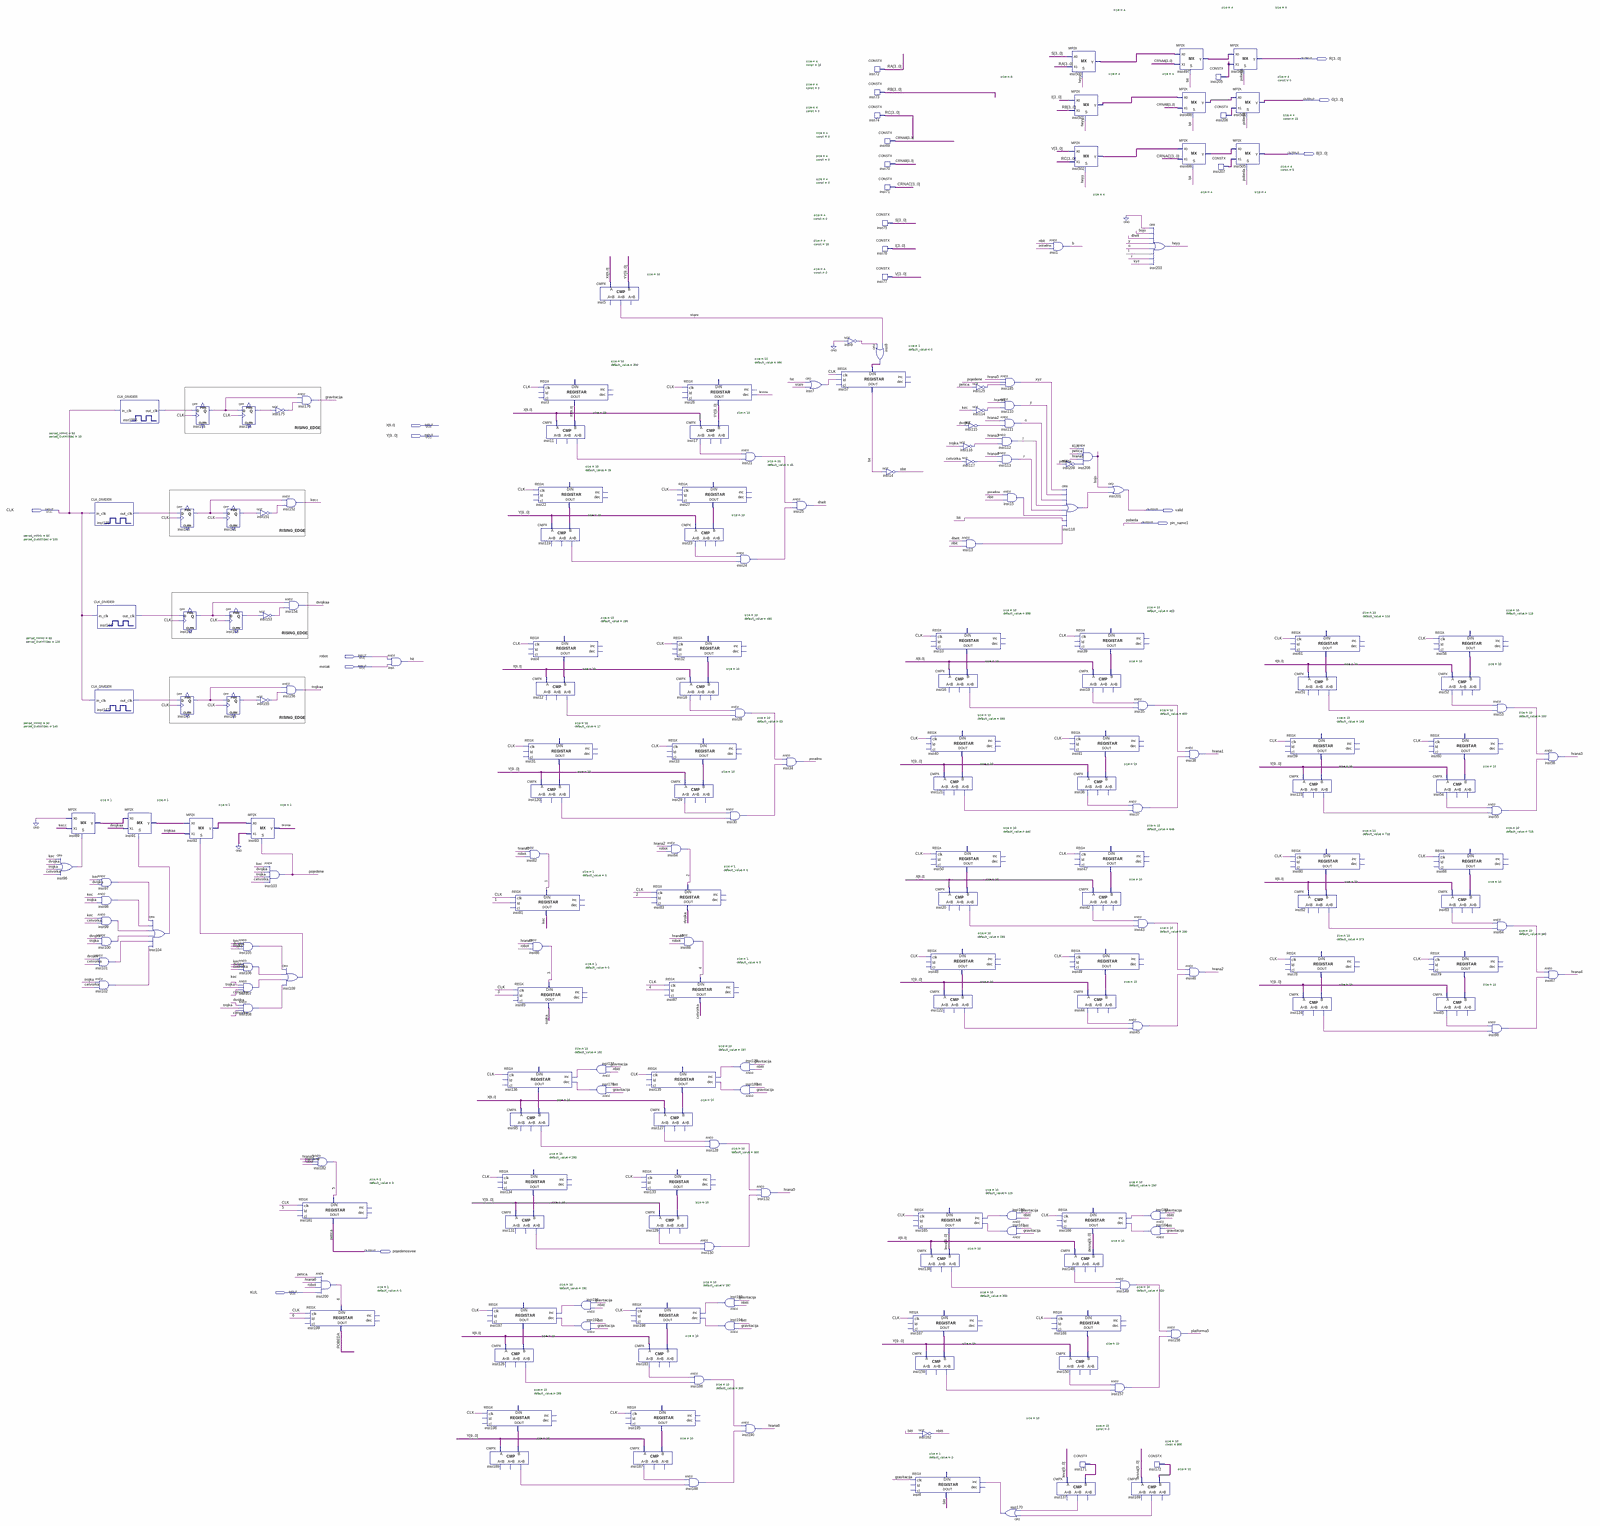
[diagram p0: schematic sheet, whole]
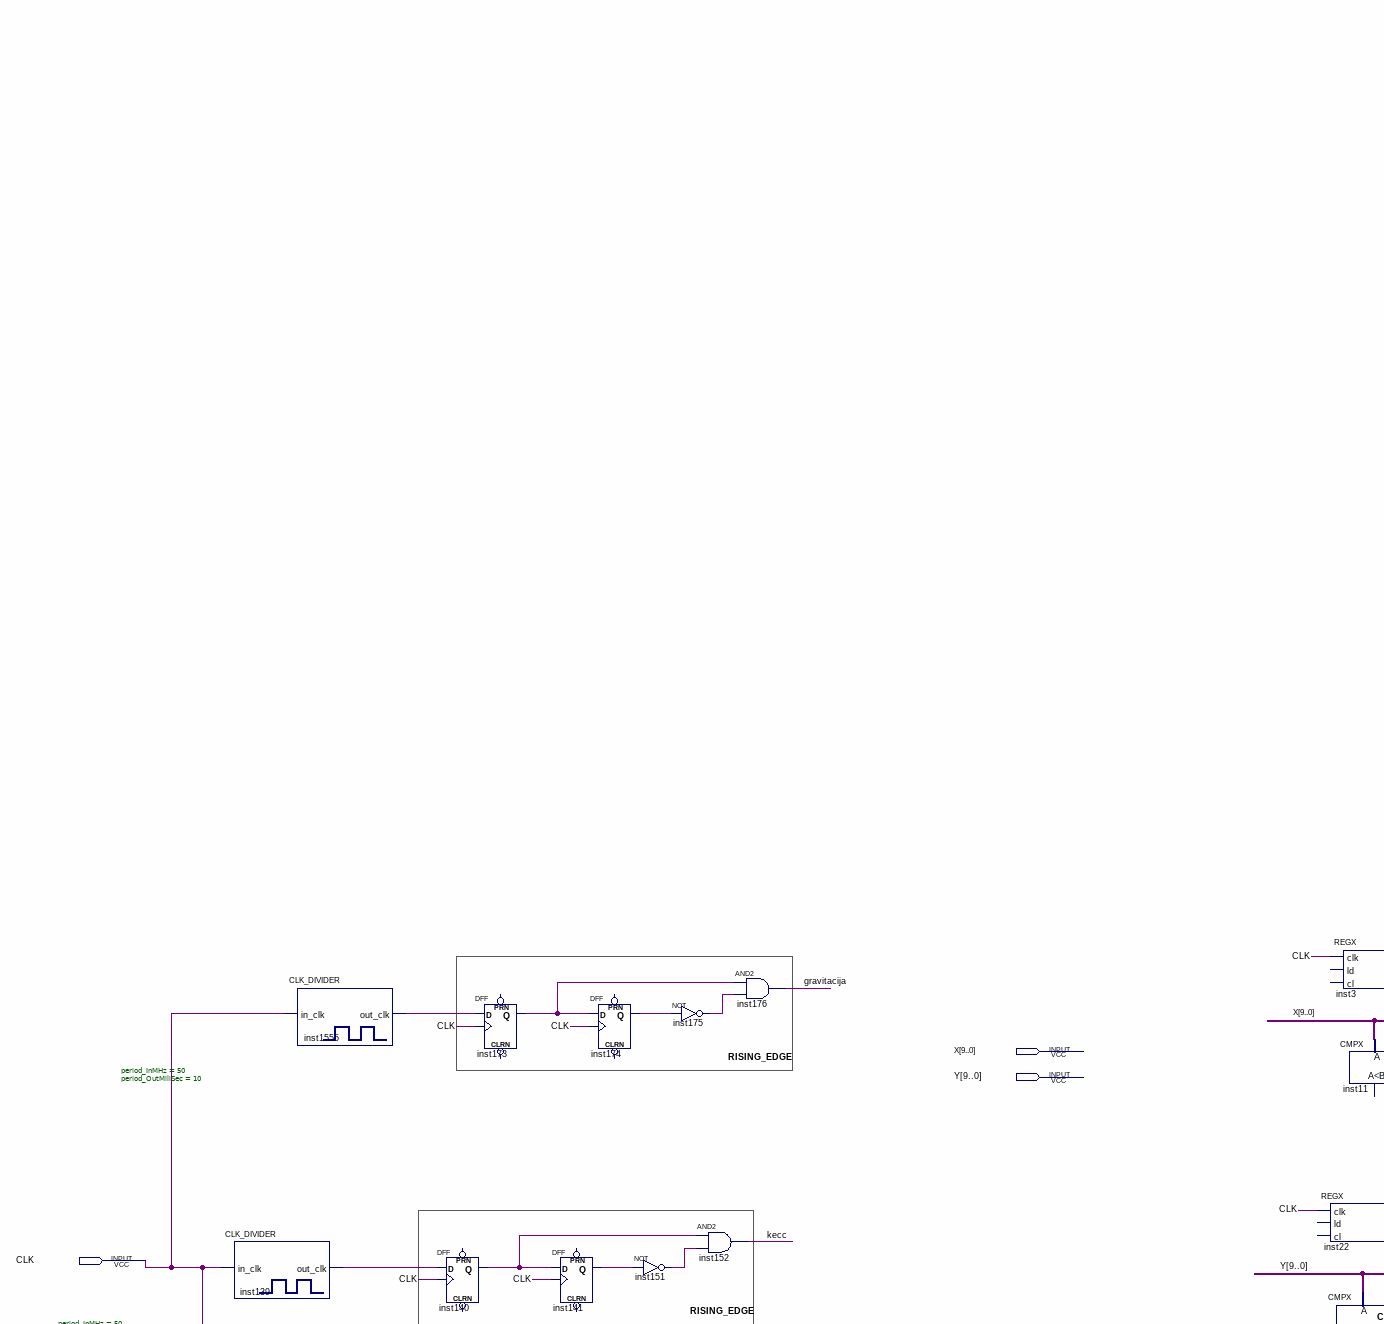
[diagram p1: schematic sheet, upper left part]
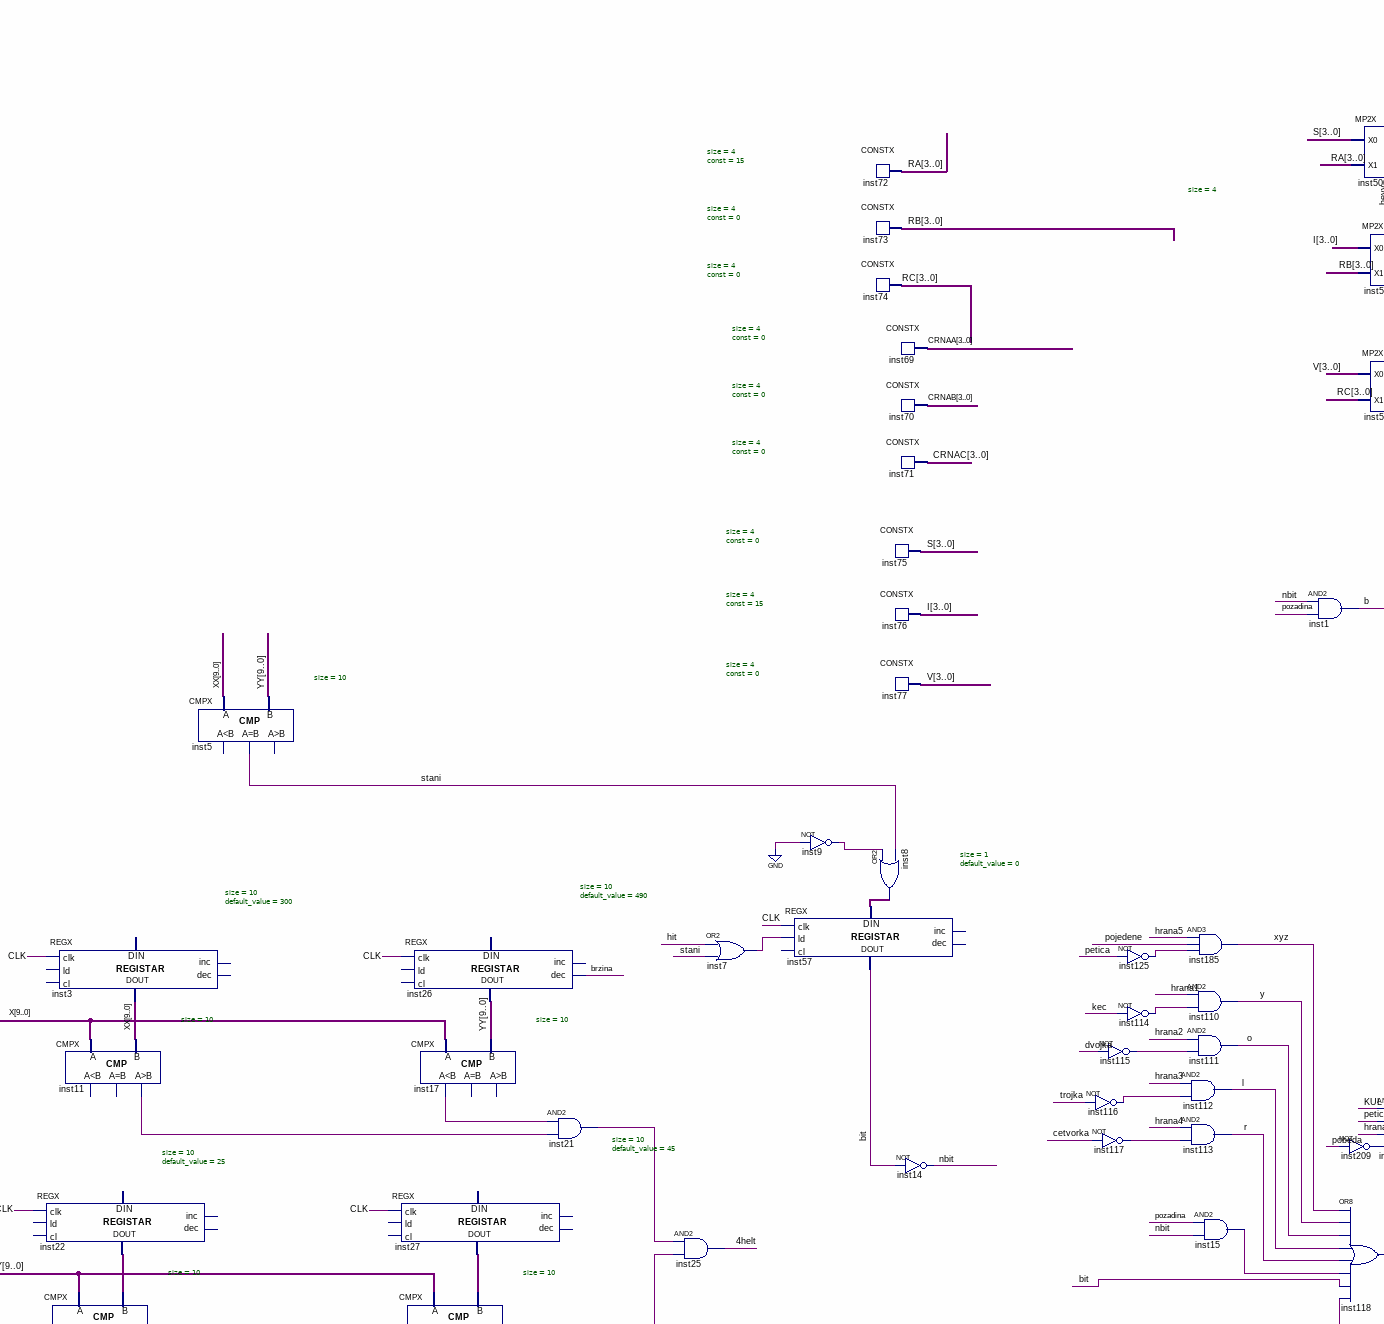
[diagram p2: schematic sheet, upper centre part]
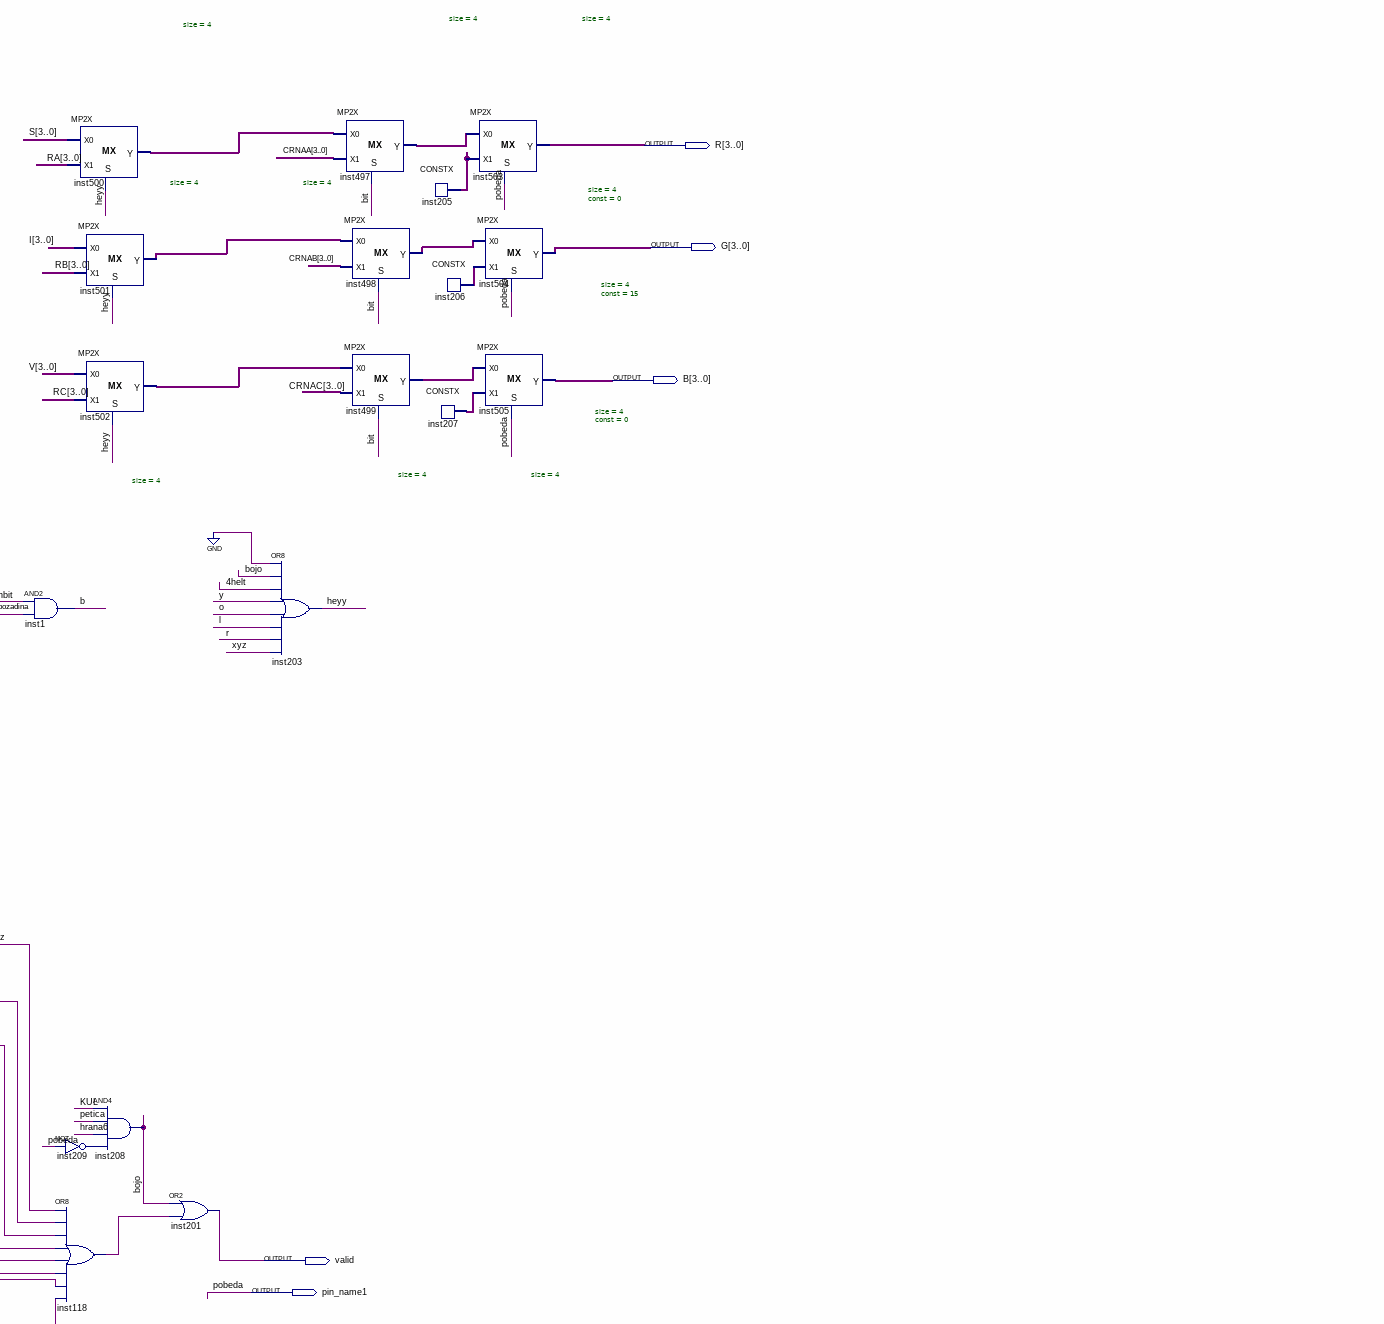
[diagram p3: schematic sheet, upper right part]
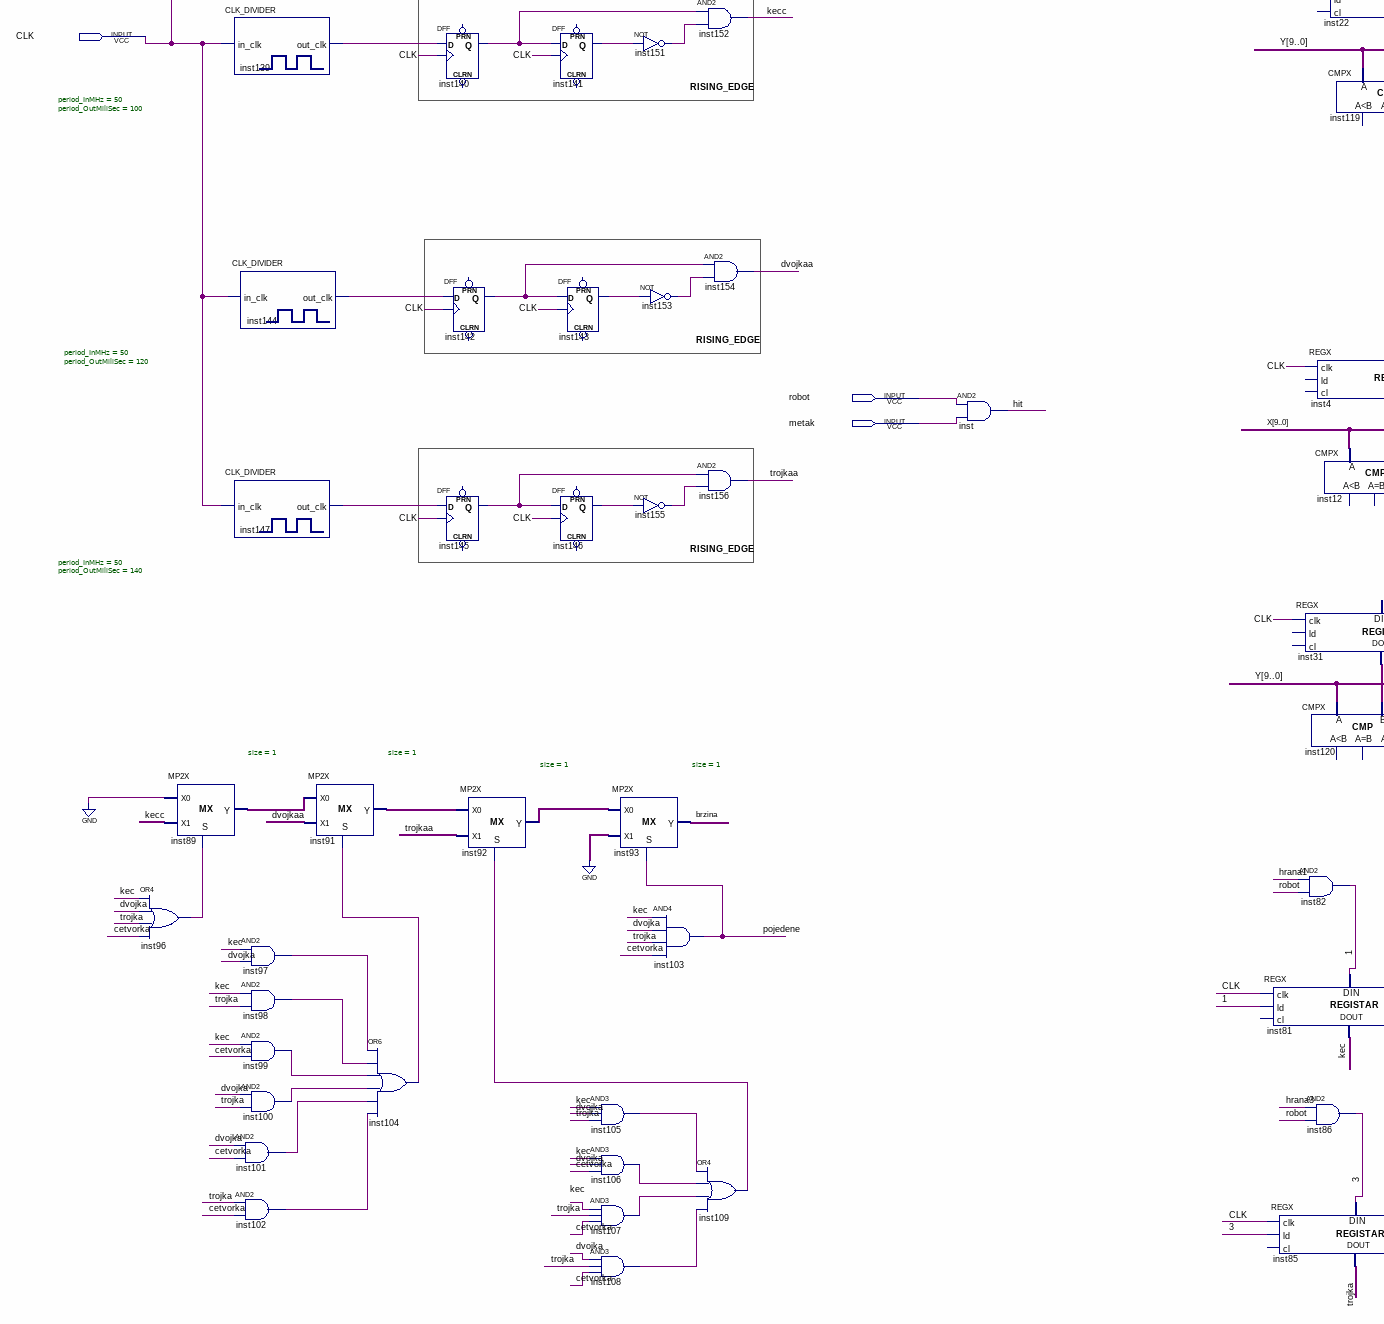
[diagram p4: schematic sheet, middle left part]
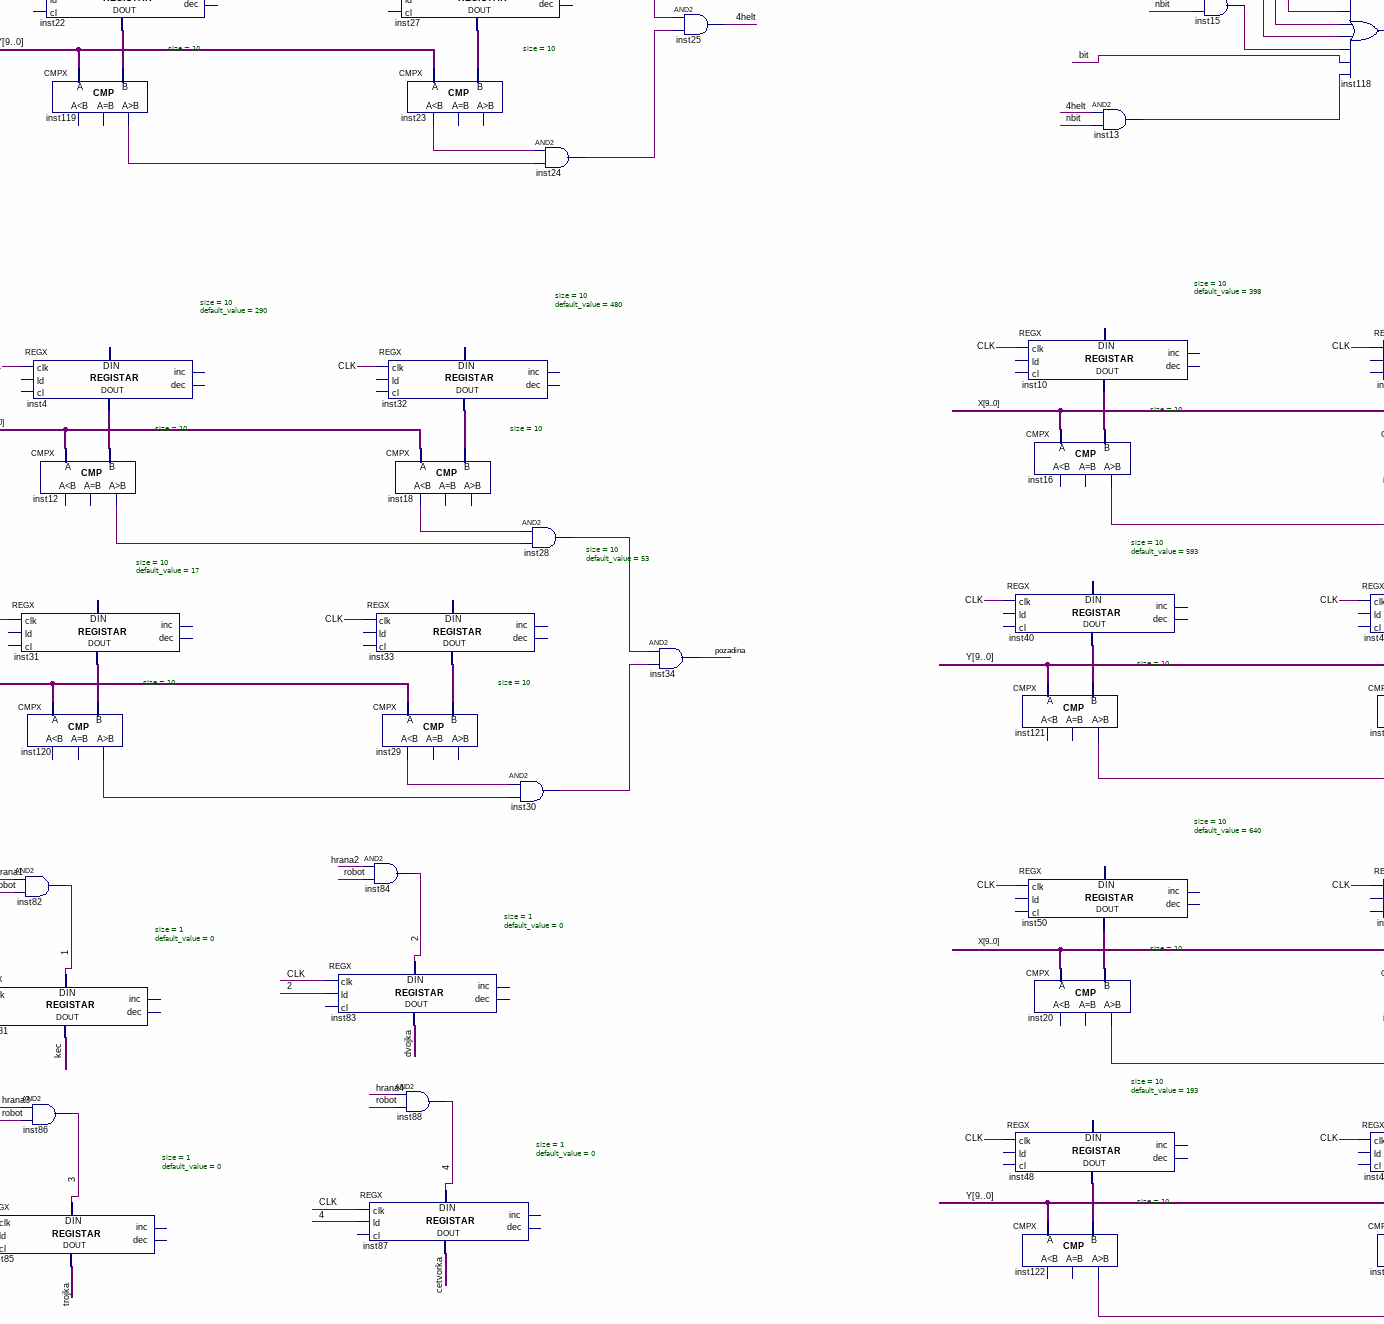
[diagram p5: schematic sheet, middle centre part]
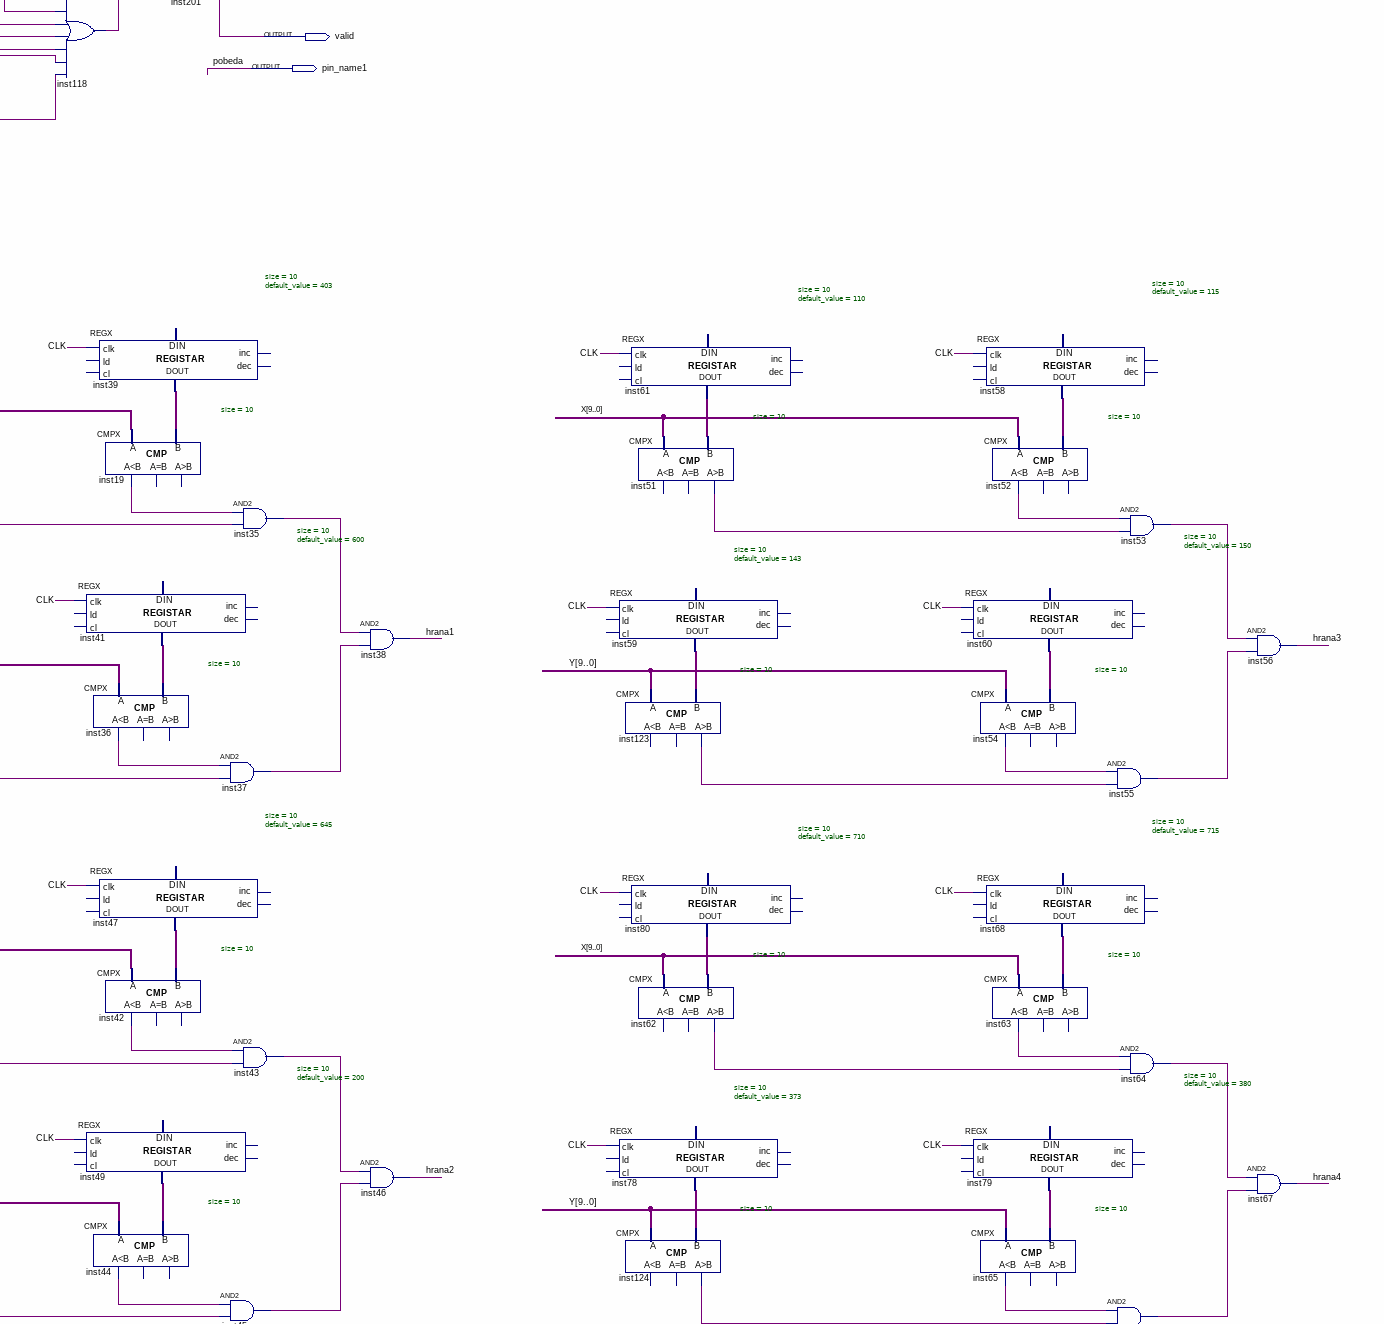
[diagram p6: schematic sheet, middle right part]
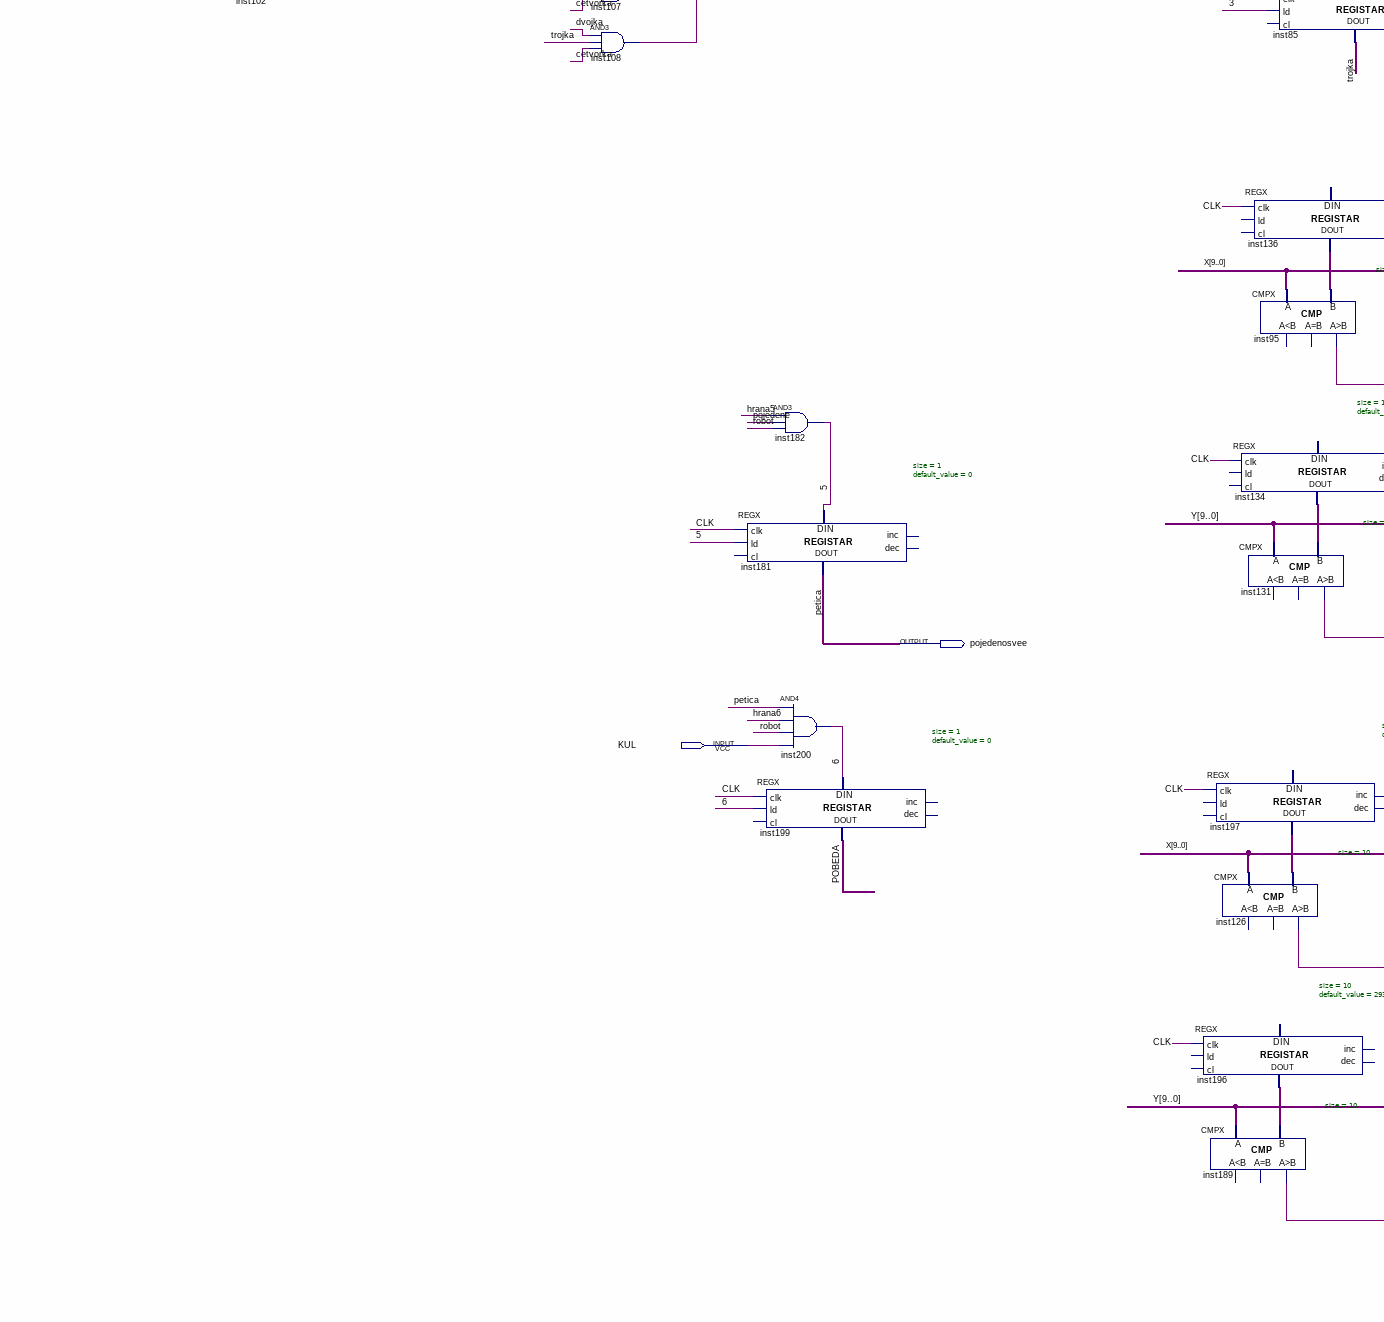
[diagram p7: schematic sheet, lower left part]
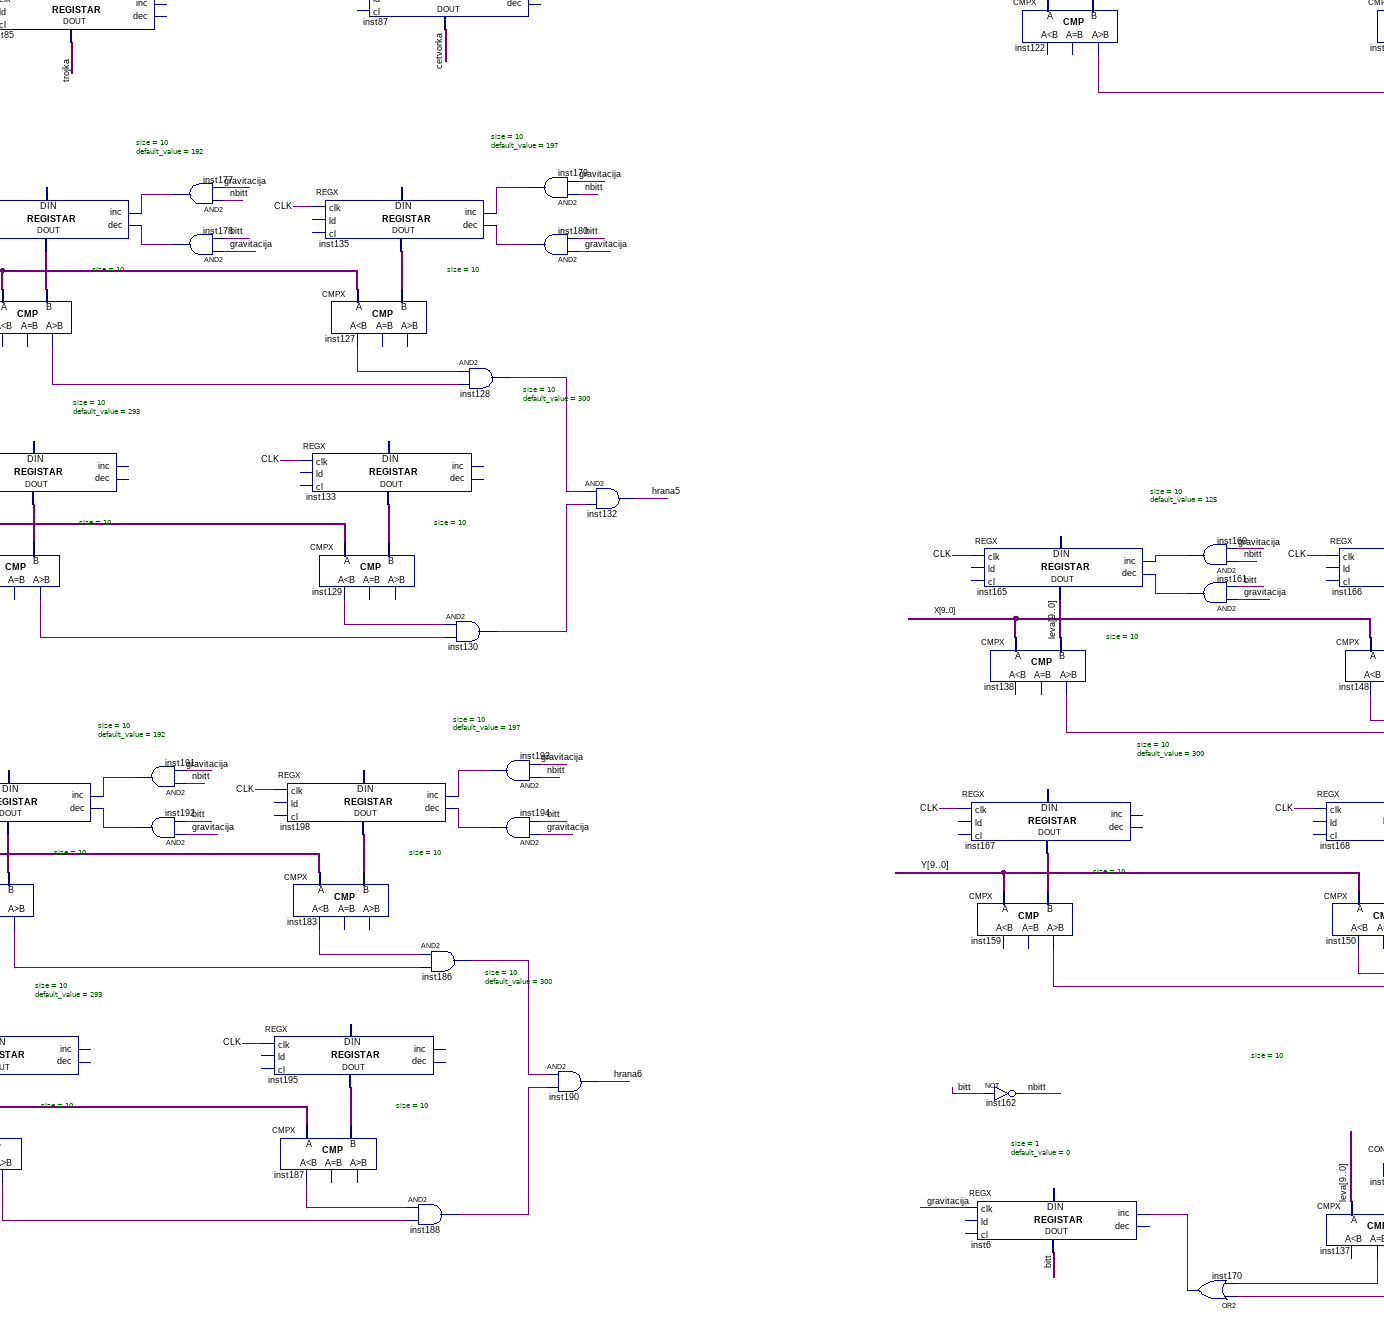
[diagram p8: schematic sheet, lower centre part]
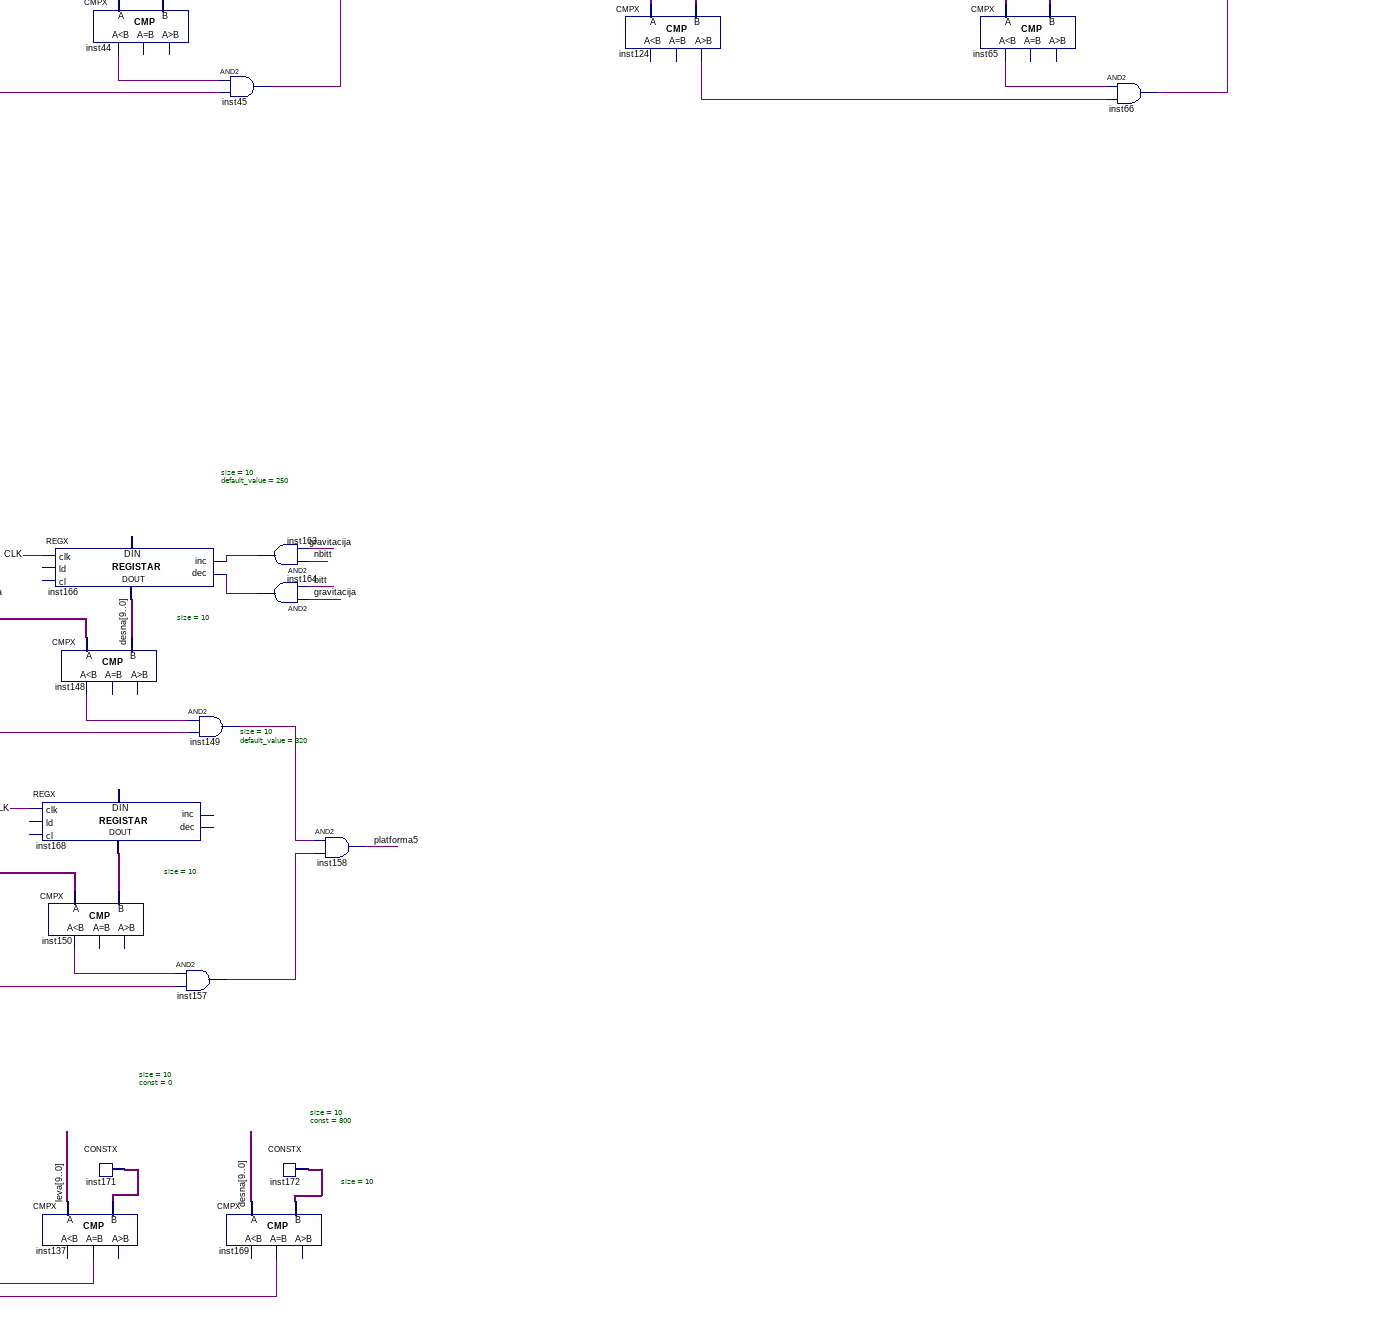
[diagram p9: schematic sheet, lower right part]
// Quartus schematic Healthbar.bdf as structural Verilog: 214 symbols, 12 pins
module Healthbar (
  input  [9:0] X,
  input  [9:0] Y,
  input  CLK,
  input  robot,
  input  metak,
  input  KUL,
  output [3:0] R,
  output [3:0] G,
  output [3:0] B,
  output valid,
  output pin_name1,
  output pojedenosvee
);

  wire \1 , \2 , \3 , \4 , \4helt , \5 , \6 , B_1bit, \bit , bitt, bojo, brzina, cetvorka, dvojka, dvojkaa,
       gravitacija, heyy, hit, hrana1, hrana2, hrana3, hrana4, hrana5, hrana6, inst7_out, inst8_out,
       inst9_out, inst11_gr, inst12_gr, inst13_out, inst15_out, inst16_gr, inst17_ls, inst18_ls, inst19_ls,
       inst20_gr, inst21_out, inst23_ls, inst24_out, inst28_out, inst29_ls, inst30_out, inst35_out,
       inst36_ls, inst37_out, inst42_ls, inst43_out, inst44_ls, inst45_out, inst51_gr, inst52_ls, inst53_out,
       inst54_ls, inst55_out, inst62_gr, inst63_ls, inst64_out, inst65_ls, inst66_out, inst89_y, inst91_y,
       inst92_y, inst95_gr, inst96_out, inst97_out, inst98_out, inst99_out, inst100_out, inst101_out,
       inst102_out, inst104_out, inst105_out, inst106_out, inst107_out, inst108_out, inst109_out,
       inst114_out, inst115_out, inst116_out, inst117_out, inst118_out, inst119_gr, inst120_gr, inst121_gr,
       inst122_gr, inst123_gr, inst124_gr, inst125_out, inst126_gr, inst127_ls, inst128_out, inst129_ls,
       inst130_out, inst131_gr, inst137_eq, inst138_gr, inst139_out_clk, inst140_q, inst141_q, inst142_q,
       inst143_q, inst144_out_clk, inst145_q, inst146_q, inst147_out_clk, inst148_ls, inst149_out,
       inst150_ls, inst151_out, inst153_out, inst155_out, inst157_out, inst159_gr, inst160_out, inst161_out,
       inst163_out, inst164_out, inst169_eq, inst170_out, inst173_q, inst174_q, inst175_out, inst177_out,
       inst178_out, inst179_out, inst180_out, inst183_ls, inst186_out, inst187_ls, inst188_out, inst189_gr,
       inst191_out, inst192_out, inst193_out, inst194_out, inst209_out, inst1555_out_clk, kec, kecc, l, nbit,
       nbitt, o, platforma5, pojedene, pozadina, R_1bit, stani, trojka, trojkaa, xyz, Y_1bit;
  wire [3:0] CRNAA, CRNAB, CRNAC, I, inst205_data, inst206_data, inst207_data, inst497_y, inst498_y,
       inst499_y, inst500_y, inst501_y, inst502_y, RA, RB, RC, S, V;
  wire [9:0] desna, inst4_data_out, inst10_data_out, inst22_data_out, inst27_data_out, inst31_data_out,
       inst32_data_out, inst33_data_out, inst39_data_out, inst40_data_out, inst41_data_out, inst47_data_out,
       inst48_data_out, inst49_data_out, inst50_data_out, inst58_data_out, inst59_data_out, inst60_data_out,
       inst61_data_out, inst68_data_out, inst78_data_out, inst79_data_out, inst80_data_out, inst133_data_out,
       inst134_data_out, inst135_data_out, inst136_data_out, inst167_data_out, inst168_data_out,
       inst171_data, inst172_data, inst195_data_out, inst196_data_out, inst197_data_out, inst198_data_out,
       leva, XX, YY;

  MP2X #(.size(1)) inst89 (.S(inst96_out), .X0(1'b0), .X1(kecc), .Y(inst89_y));
  or inst96 (inst96_out, kec, dvojka, trojka, cetvorka);
  CLK_DIVIDER #(.period_InMHz(50), .period_OutMiliSec(100)) inst139 (.in_clk(CLK), .out_clk(inst139_out_clk));
  CLK_DIVIDER #(.period_InMHz(50), .period_OutMiliSec(140)) inst147 (.in_clk(CLK), .out_clk(inst147_out_clk));
  CLK_DIVIDER #(.period_InMHz(50), .period_OutMiliSec(120)) inst144 (.in_clk(CLK), .out_clk(inst144_out_clk));
  and inst97 (inst97_out, kec, dvojka);
  and inst98 (inst98_out, kec, trojka);
  and inst99 (inst99_out, kec, cetvorka);
  and inst100 (inst100_out, dvojka, trojka);
  and inst101 (inst101_out, dvojka, cetvorka);
  and inst102 (inst102_out, trojka, cetvorka);
  CLK_DIVIDER #(.period_InMHz(50), .period_OutMiliSec(10)) inst1555 (.in_clk(CLK), .out_clk(inst1555_out_clk));
  MP2X #(.size(1)) inst91 (.S(inst104_out), .X0(inst89_y), .X1(dvojkaa), .Y(inst91_y));
  or inst104 (inst104_out, inst97_out, inst98_out, inst99_out, inst100_out, inst101_out, inst102_out);
  DFF inst173 (.CLK(CLK), .D(inst1555_out_clk), .Q(inst173_q));  // open: CLRN, PRN
  DFF inst140 (.CLK(CLK), .D(inst139_out_clk), .Q(inst140_q));  // open: CLRN, PRN
  DFF inst142 (.CLK(CLK), .D(inst144_out_clk), .Q(inst142_q));  // open: CLRN, PRN
  DFF inst145 (.CLK(CLK), .D(inst147_out_clk), .Q(inst145_q));  // open: CLRN, PRN
  MP2X #(.size(1)) inst92 (.S(inst109_out), .X0(inst91_y), .X1(trojkaa), .Y(inst92_y));
  DFF inst141 (.CLK(CLK), .D(inst140_q), .Q(inst141_q));  // open: CLRN, PRN
  DFF inst143 (.CLK(CLK), .D(inst142_q), .Q(inst143_q));  // open: CLRN, PRN
  DFF inst146 (.CLK(CLK), .D(inst145_q), .Q(inst146_q));  // open: CLRN, PRN
  DFF inst174 (.CLK(CLK), .D(inst173_q), .Q(inst174_q));  // open: CLRN, PRN
  MP2X #(.size(1)) inst93 (.S(pojedene), .X0(inst92_y), .X1(1'b0), .Y(brzina));
  and inst105 (inst105_out, kec, dvojka, trojka);
  and inst106 (inst106_out, kec, dvojka, cetvorka);
  and inst107 (inst107_out, kec, trojka, cetvorka);
  and inst108 (inst108_out, dvojka, trojka, cetvorka);
  not inst175 (inst175_out, inst174_q);
  not inst151 (inst151_out, inst141_q);
  not inst153 (inst153_out, inst143_q);
  not inst155 (inst155_out, inst146_q);
  and inst103 (pojedene, kec, dvojka, trojka, cetvorka);
  and inst152 (kecc, inst140_q, inst151_out);
  and inst154 (dvojkaa, inst142_q, inst153_out);
  and inst156 (trojkaa, inst145_q, inst155_out);
  or inst109 (inst109_out, inst105_out, inst106_out, inst107_out, inst108_out);
  and inst176 (gravitacija, inst173_q, inst175_out);
  and inst182 (\5 , hrana5, pojedene, robot);
  REGX #(.size(1), .default_value(0)) inst181 (
    .clk(CLK), .ld(\5 ), .data_in(\5 ), .data_out(pojedenosvee));  // open: cl, inc, dec
  and inst200 (\6 , pojedenosvee, hrana6, robot, KUL);
  REGX #(.size(1), .default_value(0)) inst199 (
    .clk(CLK), .ld(\6 ), .data_in(\6 ), .data_out(pin_name1));  // open: cl, inc, dec
  and inst (hit, robot, metak);
  REGX #(.size(10), .default_value(293)) inst134 (
    .clk(CLK), .data_out(inst134_data_out));  // open: ld, cl, inc, dec, data_in
  CMPX #(.size(10)) inst131 (.A(Y), .B(inst134_data_out), .gr(inst131_gr));  // open: ls, eq
  REGX #(.size(10), .default_value(192)) inst197 (
    .clk(CLK), .inc(inst191_out), .dec(inst192_out), .data_out(inst197_data_out));  // open: ld, cl, data_in
  CMPX #(.size(10)) inst126 (.A(X), .B(inst197_data_out), .gr(inst126_gr));  // open: ls, eq
  REGX #(.size(10), .default_value(293)) inst196 (
    .clk(CLK), .data_out(inst196_data_out));  // open: ld, cl, inc, dec, data_in
  CMPX #(.size(10)) inst189 (.A(Y), .B(inst196_data_out), .gr(inst189_gr));  // open: ls, eq
  REGX #(.size(1), .default_value(0)) inst81 (
    .clk(CLK), .ld(\1 ), .data_in(\1 ), .data_out(kec));  // open: cl, inc, dec
  REGX #(.size(1), .default_value(0)) inst85 (
    .clk(CLK), .ld(\3 ), .data_in(\3 ), .data_out(trojka));  // open: cl, inc, dec
  REGX #(.size(10), .default_value(192)) inst136 (
    .clk(CLK), .inc(inst177_out), .dec(inst178_out), .data_out(inst136_data_out));  // open: ld, cl, data_in
  CMPX #(.size(10)) inst95 (.A(X), .B(inst136_data_out), .gr(inst95_gr));  // open: ls, eq
  REGX #(.size(10), .default_value(300)) inst3 (.clk(CLK), .data_out(XX));  // open: ld, cl, inc, dec, data_in
  CMPX #(.size(10)) inst11 (.A(X), .B(XX), .gr(inst11_gr));  // open: ls, eq
  REGX #(.size(10), .default_value(25)) inst22 (
    .clk(CLK), .data_out(inst22_data_out));  // open: ld, cl, inc, dec, data_in
  CMPX #(.size(10)) inst119 (.A(Y), .B(inst22_data_out), .gr(inst119_gr));  // open: ls, eq
  REGX #(.size(10), .default_value(290)) inst4 (
    .clk(CLK), .data_out(inst4_data_out));  // open: ld, cl, inc, dec, data_in
  CMPX #(.size(10)) inst12 (.A(X), .B(inst4_data_out), .gr(inst12_gr));  // open: ls, eq
  REGX #(.size(10), .default_value(17)) inst31 (
    .clk(CLK), .data_out(inst31_data_out));  // open: ld, cl, inc, dec, data_in
  CMPX #(.size(10)) inst120 (.A(Y), .B(inst31_data_out), .gr(inst120_gr));  // open: ls, eq
  and inst82 (\1 , hrana1, robot);
  and inst86 (\3 , hrana3, robot);
  and inst191 (inst191_out, nbitt, gravitacija);
  and inst192 (inst192_out, gravitacija, bitt);
  CMPX #(.size(10)) inst5 (.A(XX), .B(YY), .eq(stani));  // open: ls, gr
  and inst177 (inst177_out, nbitt, gravitacija);
  and inst178 (inst178_out, gravitacija, bitt);
  REGX #(.size(10), .default_value(300)) inst133 (
    .clk(CLK), .data_out(inst133_data_out));  // open: ld, cl, inc, dec, data_in
  CMPX #(.size(10)) inst129 (.A(Y), .B(inst133_data_out), .ls(inst129_ls));  // open: eq, gr
  REGX #(.size(10), .default_value(197)) inst198 (
    .clk(CLK), .inc(inst193_out), .dec(inst194_out), .data_out(inst198_data_out));  // open: ld, cl, data_in
  CMPX #(.size(10)) inst183 (.A(X), .B(inst198_data_out), .ls(inst183_ls));  // open: eq, gr
  REGX #(.size(10), .default_value(300)) inst195 (
    .clk(CLK), .data_out(inst195_data_out));  // open: ld, cl, inc, dec, data_in
  CMPX #(.size(10)) inst187 (.A(Y), .B(inst195_data_out), .ls(inst187_ls));  // open: eq, gr
  REGX #(.size(1), .default_value(0)) inst83 (
    .clk(CLK), .ld(\2 ), .data_in(\2 ), .data_out(dvojka));  // open: cl, inc, dec
  REGX #(.size(1), .default_value(0)) inst87 (
    .clk(CLK), .ld(\4 ), .data_in(\4 ), .data_out(cetvorka));  // open: cl, inc, dec
  REGX #(.size(10), .default_value(197)) inst135 (
    .clk(CLK), .inc(inst179_out), .dec(inst180_out), .data_out(inst135_data_out));  // open: ld, cl, data_in
  CMPX #(.size(10)) inst127 (.A(X), .B(inst135_data_out), .ls(inst127_ls));  // open: eq, gr
  REGX #(.size(10), .default_value(490)) inst26 (.clk(CLK), .dec(brzina), .data_out(YY));  // open: ld, cl, inc, data_in
  CMPX #(.size(10)) inst17 (.A(X), .B(YY), .ls(inst17_ls));  // open: eq, gr
  REGX #(.size(10), .default_value(45)) inst27 (
    .clk(CLK), .data_out(inst27_data_out));  // open: ld, cl, inc, dec, data_in
  CMPX #(.size(10)) inst23 (.A(Y), .B(inst27_data_out), .ls(inst23_ls));  // open: eq, gr
  REGX #(.size(10), .default_value(480)) inst32 (
    .clk(CLK), .data_out(inst32_data_out));  // open: ld, cl, inc, dec, data_in
  CMPX #(.size(10)) inst18 (.A(X), .B(inst32_data_out), .ls(inst18_ls));  // open: eq, gr
  REGX #(.size(10), .default_value(53)) inst33 (
    .clk(CLK), .data_out(inst33_data_out));  // open: ld, cl, inc, dec, data_in
  CMPX #(.size(10)) inst29 (.A(Y), .B(inst33_data_out), .ls(inst29_ls));  // open: eq, gr
  and inst84 (\2 , hrana2, robot);
  and inst88 (\4 , hrana4, robot);
  and inst188 (inst188_out, inst187_ls, inst189_gr);
  and inst128 (inst128_out, inst127_ls, inst95_gr);
  and inst130 (inst130_out, inst129_ls, inst131_gr);
  and inst186 (inst186_out, inst183_ls, inst126_gr);
  and inst30 (inst30_out, inst29_ls, inst120_gr);
  and inst193 (inst193_out, nbitt, gravitacija);
  and inst194 (inst194_out, gravitacija, bitt);
  and inst21 (inst21_out, inst17_ls, inst11_gr);
  and inst24 (inst24_out, inst23_ls, inst119_gr);
  and inst28 (inst28_out, inst18_ls, inst12_gr);
  and inst179 (inst179_out, nbitt, gravitacija);
  and inst180 (inst180_out, gravitacija, bitt);
  and inst190 (hrana6, inst186_out, inst188_out);
  and inst132 (hrana5, inst128_out, inst130_out);
  and inst34 (pozadina, inst28_out, inst30_out);
  or inst7 (inst7_out, hit, stani);
  and inst25 (\4helt , inst21_out, inst24_out);
  not inst9 (inst9_out, 1'b0);
  REGX #(.size(1), .default_value(0)) inst57 (
    .clk(CLK), .ld(inst7_out), .data_in(inst8_out), .data_out(\bit ));  // open: cl, inc, dec
  CONSTX #(.size(4), .\const (15)) inst72 (.data(RA));
  CONSTX #(.size(4), .\const (0)) inst73 (.data(RB));
  CONSTX #(.size(4), .\const (0)) inst74 (.data(RC));
  CONSTX #(.size(4), .\const (0)) inst69 (.data(CRNAA));
  CONSTX #(.size(4), .\const (0)) inst70 (.data(CRNAB));
  CONSTX #(.size(4), .\const (0)) inst71 (.data(CRNAC));
  CONSTX #(.size(4), .\const (0)) inst75 (.data(S));
  CONSTX #(.size(4), .\const (15)) inst76 (.data(I));
  CONSTX #(.size(4), .\const (0)) inst77 (.data(V));
  or inst8 (inst8_out, inst9_out, stani);
  not inst14 (nbit, \bit );
  REGX #(.size(10), .default_value(300)) inst167 (
    .clk(CLK), .data_out(inst167_data_out));  // open: ld, cl, inc, dec, data_in
  CMPX #(.size(10)) inst159 (.A(Y), .B(inst167_data_out), .gr(inst159_gr));  // open: ls, eq
  REGX #(.size(1), .default_value(0)) inst6 (
    .clk(gravitacija), .inc(inst170_out), .data_out(bitt));  // open: ld, cl, dec, data_in
  REGX #(.size(10), .default_value(398)) inst10 (
    .clk(CLK), .data_out(inst10_data_out));  // open: ld, cl, inc, dec, data_in
  REGX #(.size(10), .default_value(593)) inst40 (
    .clk(CLK), .data_out(inst40_data_out));  // open: ld, cl, inc, dec, data_in
  CMPX #(.size(10)) inst121 (.A(Y), .B(inst40_data_out), .gr(inst121_gr));  // open: ls, eq
  REGX #(.size(10), .default_value(640)) inst50 (
    .clk(CLK), .data_out(inst50_data_out));  // open: ld, cl, inc, dec, data_in
  REGX #(.size(10), .default_value(193)) inst48 (
    .clk(CLK), .data_out(inst48_data_out));  // open: ld, cl, inc, dec, data_in
  CMPX #(.size(10)) inst122 (.A(Y), .B(inst48_data_out), .gr(inst122_gr));  // open: ls, eq
  REGX #(.size(10), .default_value(125)) inst165 (
    .clk(CLK), .inc(inst160_out), .dec(inst161_out), .data_out(leva));  // open: ld, cl, data_in
  CMPX #(.size(10)) inst138 (.A(X), .B(leva), .gr(inst138_gr));  // open: ls, eq
  not inst162 (nbitt, bitt);
  CMPX #(.size(10)) inst16 (.A(X), .B(inst10_data_out), .gr(inst16_gr));  // open: ls, eq
  CMPX #(.size(10)) inst20 (.A(X), .B(inst50_data_out), .gr(inst20_gr));  // open: ls, eq
  not inst125 (inst125_out, pojedenosvee);
  not inst114 (inst114_out, kec);
  not inst115 (inst115_out, dvojka);
  not inst116 (inst116_out, trojka);
  not inst117 (inst117_out, cetvorka);
  and inst13 (inst13_out, \4helt , nbit);
  and inst185 (xyz, hrana5, pojedene, inst125_out);
  and inst110 (Y_1bit, hrana1, inst114_out);
  and inst111 (o, hrana2, inst115_out);
  and inst112 (l, hrana3, inst116_out);
  and inst113 (R_1bit, hrana4, inst117_out);
  and inst15 (inst15_out, pozadina, nbit);
  and inst160 (inst160_out, nbitt, gravitacija);
  and inst161 (inst161_out, gravitacija, bitt);
  or inst170 (inst170_out, inst169_eq, inst137_eq);
  and inst1 (B_1bit, nbit, pozadina);
  REGX #(.size(10), .default_value(320)) inst168 (
    .clk(CLK), .data_out(inst168_data_out));  // open: ld, cl, inc, dec, data_in
  CMPX #(.size(10)) inst150 (.A(Y), .B(inst168_data_out), .ls(inst150_ls));  // open: eq, gr
  CMPX #(.size(10)) inst137 (.A(leva), .B(inst171_data), .eq(inst137_eq));  // open: ls, gr
  MP2X #(.size(4)) inst500 (.S(heyy), .X0(S), .X1(RA), .Y(inst500_y));
  MP2X #(.size(4)) inst501 (.S(heyy), .X0(I), .X1(RB), .Y(inst501_y));
  MP2X #(.size(4)) inst502 (.S(heyy), .X0(V), .X1(RC), .Y(inst502_y));
  not inst209 (inst209_out, pin_name1);
  or inst118 (inst118_out, xyz, Y_1bit, o, l, R_1bit, inst15_out, \bit , inst13_out);
  REGX #(.size(10), .default_value(403)) inst39 (
    .clk(CLK), .data_out(inst39_data_out));  // open: ld, cl, inc, dec, data_in
  REGX #(.size(10), .default_value(600)) inst41 (
    .clk(CLK), .data_out(inst41_data_out));  // open: ld, cl, inc, dec, data_in
  CMPX #(.size(10)) inst36 (.A(Y), .B(inst41_data_out), .ls(inst36_ls));  // open: eq, gr
  REGX #(.size(10), .default_value(645)) inst47 (
    .clk(CLK), .data_out(inst47_data_out));  // open: ld, cl, inc, dec, data_in
  REGX #(.size(10), .default_value(200)) inst49 (
    .clk(CLK), .data_out(inst49_data_out));  // open: ld, cl, inc, dec, data_in
  CMPX #(.size(10)) inst44 (.A(Y), .B(inst49_data_out), .ls(inst44_ls));  // open: eq, gr
  REGX #(.size(10), .default_value(250)) inst166 (
    .clk(CLK), .inc(inst163_out), .dec(inst164_out), .data_out(desna));  // open: ld, cl, data_in
  CMPX #(.size(10)) inst148 (.A(X), .B(desna), .ls(inst148_ls));  // open: eq, gr
  CONSTX #(.size(10), .\const (0)) inst171 (.data(inst171_data));
  and inst208 (bojo, KUL, pojedenosvee, hrana6, inst209_out);
  CMPX #(.size(10)) inst19 (.A(X), .B(inst39_data_out), .ls(inst19_ls));  // open: eq, gr
  CMPX #(.size(10)) inst42 (.A(X), .B(inst47_data_out), .ls(inst42_ls));  // open: eq, gr
  or inst201 (valid, bojo, inst118_out);
  and inst149 (inst149_out, inst148_ls, inst138_gr);
  and inst157 (inst157_out, inst150_ls, inst159_gr);
  and inst35 (inst35_out, inst19_ls, inst16_gr);
  and inst37 (inst37_out, inst36_ls, inst121_gr);
  and inst43 (inst43_out, inst42_ls, inst20_gr);
  and inst45 (inst45_out, inst44_ls, inst122_gr);
  CMPX #(.size(10)) inst169 (.A(desna), .B(inst172_data), .eq(inst169_eq));  // open: ls, gr
  or inst203 (heyy, 1'b0, bojo, \4helt , Y_1bit, o, l, R_1bit, xyz);
  and inst163 (inst163_out, nbitt, gravitacija);
  and inst164 (inst164_out, gravitacija, bitt);
  CONSTX #(.size(10), .\const (800)) inst172 (.data(inst172_data));
  MP2X #(.size(4)) inst497 (.S(\bit ), .X0(inst500_y), .X1(CRNAA), .Y(inst497_y));
  MP2X #(.size(4)) inst498 (.S(\bit ), .X0(inst501_y), .X1(CRNAB), .Y(inst498_y));
  MP2X #(.size(4)) inst499 (.S(\bit ), .X0(inst502_y), .X1(CRNAC), .Y(inst499_y));
  and inst158 (platforma5, inst149_out, inst157_out);
  and inst38 (hrana1, inst35_out, inst37_out);
  and inst46 (hrana2, inst43_out, inst45_out);
  CONSTX #(.size(4), .\const (0)) inst205 (.data(inst205_data));
  CONSTX #(.size(4), .\const (15)) inst206 (.data(inst206_data));
  CONSTX #(.size(4), .\const (0)) inst207 (.data(inst207_data));
  MP2X #(.size(4)) inst503 (.S(pin_name1), .X0(inst497_y), .X1(inst205_data), .Y(R));
  MP2X #(.size(4)) inst504 (.S(pin_name1), .X0(inst498_y), .X1(inst206_data), .Y(G));
  MP2X #(.size(4)) inst505 (.S(pin_name1), .X0(inst499_y), .X1(inst207_data), .Y(B));
  REGX #(.size(10), .default_value(110)) inst61 (
    .clk(CLK), .data_out(inst61_data_out));  // open: ld, cl, inc, dec, data_in
  CMPX #(.size(10)) inst51 (.A(X), .B(inst61_data_out), .gr(inst51_gr));  // open: ls, eq
  REGX #(.size(10), .default_value(143)) inst59 (
    .clk(CLK), .data_out(inst59_data_out));  // open: ld, cl, inc, dec, data_in
  CMPX #(.size(10)) inst123 (.A(Y), .B(inst59_data_out), .gr(inst123_gr));  // open: ls, eq
  REGX #(.size(10), .default_value(710)) inst80 (
    .clk(CLK), .data_out(inst80_data_out));  // open: ld, cl, inc, dec, data_in
  CMPX #(.size(10)) inst62 (.A(X), .B(inst80_data_out), .gr(inst62_gr));  // open: ls, eq
  REGX #(.size(10), .default_value(373)) inst78 (
    .clk(CLK), .data_out(inst78_data_out));  // open: ld, cl, inc, dec, data_in
  CMPX #(.size(10)) inst124 (.A(Y), .B(inst78_data_out), .gr(inst124_gr));  // open: ls, eq
  REGX #(.size(10), .default_value(115)) inst58 (
    .clk(CLK), .data_out(inst58_data_out));  // open: ld, cl, inc, dec, data_in
  CMPX #(.size(10)) inst52 (.A(X), .B(inst58_data_out), .ls(inst52_ls));  // open: eq, gr
  REGX #(.size(10), .default_value(150)) inst60 (
    .clk(CLK), .data_out(inst60_data_out));  // open: ld, cl, inc, dec, data_in
  CMPX #(.size(10)) inst54 (.A(Y), .B(inst60_data_out), .ls(inst54_ls));  // open: eq, gr
  REGX #(.size(10), .default_value(715)) inst68 (
    .clk(CLK), .data_out(inst68_data_out));  // open: ld, cl, inc, dec, data_in
  CMPX #(.size(10)) inst63 (.A(X), .B(inst68_data_out), .ls(inst63_ls));  // open: eq, gr
  REGX #(.size(10), .default_value(380)) inst79 (
    .clk(CLK), .data_out(inst79_data_out));  // open: ld, cl, inc, dec, data_in
  CMPX #(.size(10)) inst65 (.A(Y), .B(inst79_data_out), .ls(inst65_ls));  // open: eq, gr
  and inst53 (inst53_out, inst52_ls, inst51_gr);
  and inst55 (inst55_out, inst54_ls, inst123_gr);
  and inst64 (inst64_out, inst63_ls, inst62_gr);
  and inst66 (inst66_out, inst65_ls, inst124_gr);
  and inst56 (hrana3, inst53_out, inst55_out);
  and inst67 (hrana4, inst64_out, inst66_out);

  // Other names for the same wires on the sheet: petica = pojedenosvee; POBEDA = pin_name1

  // Notes on the sheet:
  //   RISING_EDGE
  //   RISING_EDGE
  //   RISING_EDGE
  //   RISING_EDGE
endmodule
